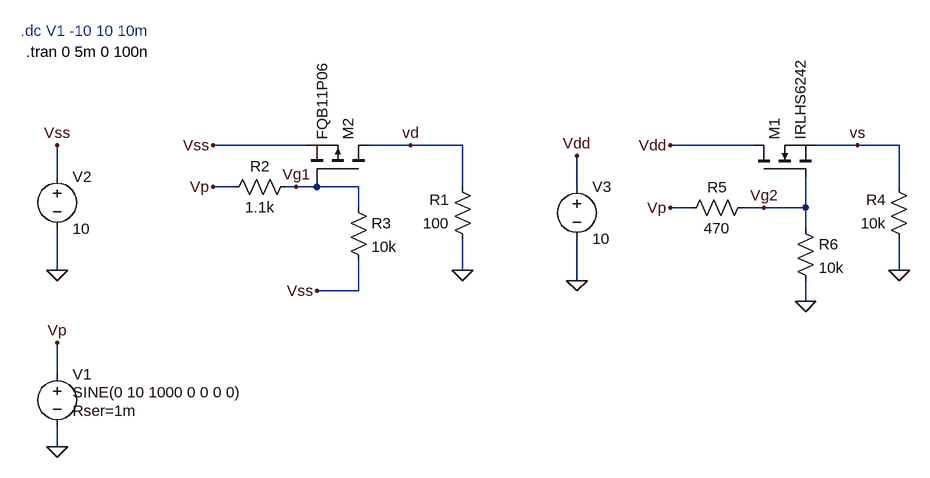
[diagram p0: schematic Draft5.asc]
Draft5.asc, the LTspice schematic file:
Version 4
SHEET 1 1092 680
WIRE 160 0 16 0
WIRE 320 0 256 0
WIRE 400 0 320 0
WIRE 848 0 720 0
WIRE 1008 0 944 0
WIRE 1072 0 1008 0
WIRE -224 48 -224 0
WIRE 48 64 16 64
WIRE 144 64 128 64
WIRE 176 64 176 48
WIRE 176 64 144 64
WIRE 240 64 176 64
WIRE 400 64 400 0
WIRE 576 64 576 16
WIRE 1072 64 1072 0
WIRE 240 96 240 64
WIRE 752 96 720 96
WIRE 864 96 832 96
WIRE 928 96 928 48
WIRE 928 96 864 96
WIRE 928 128 928 96
WIRE -224 192 -224 128
WIRE 400 192 400 144
WIRE 1072 192 1072 144
WIRE 576 208 576 144
WIRE 240 224 240 176
WIRE 240 224 176 224
WIRE 928 240 928 208
WIRE -224 352 -224 304
WIRE -224 464 -224 432
FLAG -224 192 0
FLAG 400 192 0
FLAG -224 464 0
FLAG 1072 192 0
FLAG -224 0 Vss
FLAG 720 0 Vdd
FLAG 16 0 Vss
FLAG -224 304 Vp
FLAG 16 64 Vp
FLAG 720 96 Vp
FLAG 176 224 Vss
FLAG 928 240 0
FLAG 576 208 0
FLAG 576 16 Vdd
FLAG 1008 0 vs
FLAG 320 0 vd
FLAG 144 64 Vg1
FLAG 864 96 Vg2
SYMBOL voltage -224 336 R0
WINDOW 3 24 44 Left 2
WINDOW 123 0 0 Left 0
WINDOW 39 24 72 Left 2
SYMATTR InstName V1
SYMATTR Value SINE(0 10 1000 0 0 0 0)
SYMATTR SpiceLine Rser=1m
SYMBOL res 416 160 R180
WINDOW 0 36 76 Left 2
WINDOW 3 36 40 Left 2
SYMATTR InstName R1
SYMATTR Value 100
SYMBOL res 224 80 R0
SYMATTR InstName R3
SYMATTR Value 10k
SYMBOL voltage -224 32 R0
WINDOW 123 0 0 Left 0
WINDOW 39 0 0 Left 0
SYMATTR InstName V2
SYMATTR Value 10
SYMBOL pmos 256 48 M270
SYMATTR InstName M2
SYMATTR Value FQB11P06
SYMBOL res 144 48 R90
WINDOW 0 0 56 VBottom 2
WINDOW 3 32 56 VTop 2
SYMATTR InstName R2
SYMATTR Value 1.1k
SYMBOL nmos 848 48 R270
SYMATTR InstName M1
SYMATTR Value IRLHS6242
SYMBOL res 1088 160 R180
WINDOW 0 36 76 Left 2
WINDOW 3 36 40 Left 2
SYMATTR InstName R4
SYMATTR Value 10k
SYMBOL res 848 80 R90
WINDOW 0 0 56 VBottom 2
WINDOW 3 32 56 VTop 2
SYMATTR InstName R5
SYMATTR Value 470
SYMBOL res 912 112 R0
SYMATTR InstName R6
SYMATTR Value 10k
SYMBOL voltage 576 48 R0
WINDOW 123 0 0 Left 0
WINDOW 39 0 0 Left 0
SYMATTR InstName V3
SYMATTR Value 10
TEXT -272 -144 Left 2 !.tran 0 5m 0 100n
TEXT -280 -176 Left 2 ;.dc V1 -10 10 10m

The netlist it stands for:
* Draft5.asc
V1 Vp 0 SINE(0 10 1000 0 0 0 0) Rser=1m
R1 0 vd 100
R3 Vg1 Vss 10k
V2 Vss 0 10
M2 vd Vg1 Vss Vss FQB11P06
R2 Vg1 Vp 1.1k
M1 Vdd Vg2 vs vs IRLHS6242
R4 0 vs 10k
R5 Vg2 Vp 470
R6 Vg2 0 10k
V3 Vdd 0 10
.model NMOS NMOS
.model PMOS PMOS
.lib standard.mos
.tran 0 5m 0 100n
* .dc V1 -10 10 10m
.backanno
.end